# EAGLE design Orpheus Leap Micro (EAGLE 9.6.2)
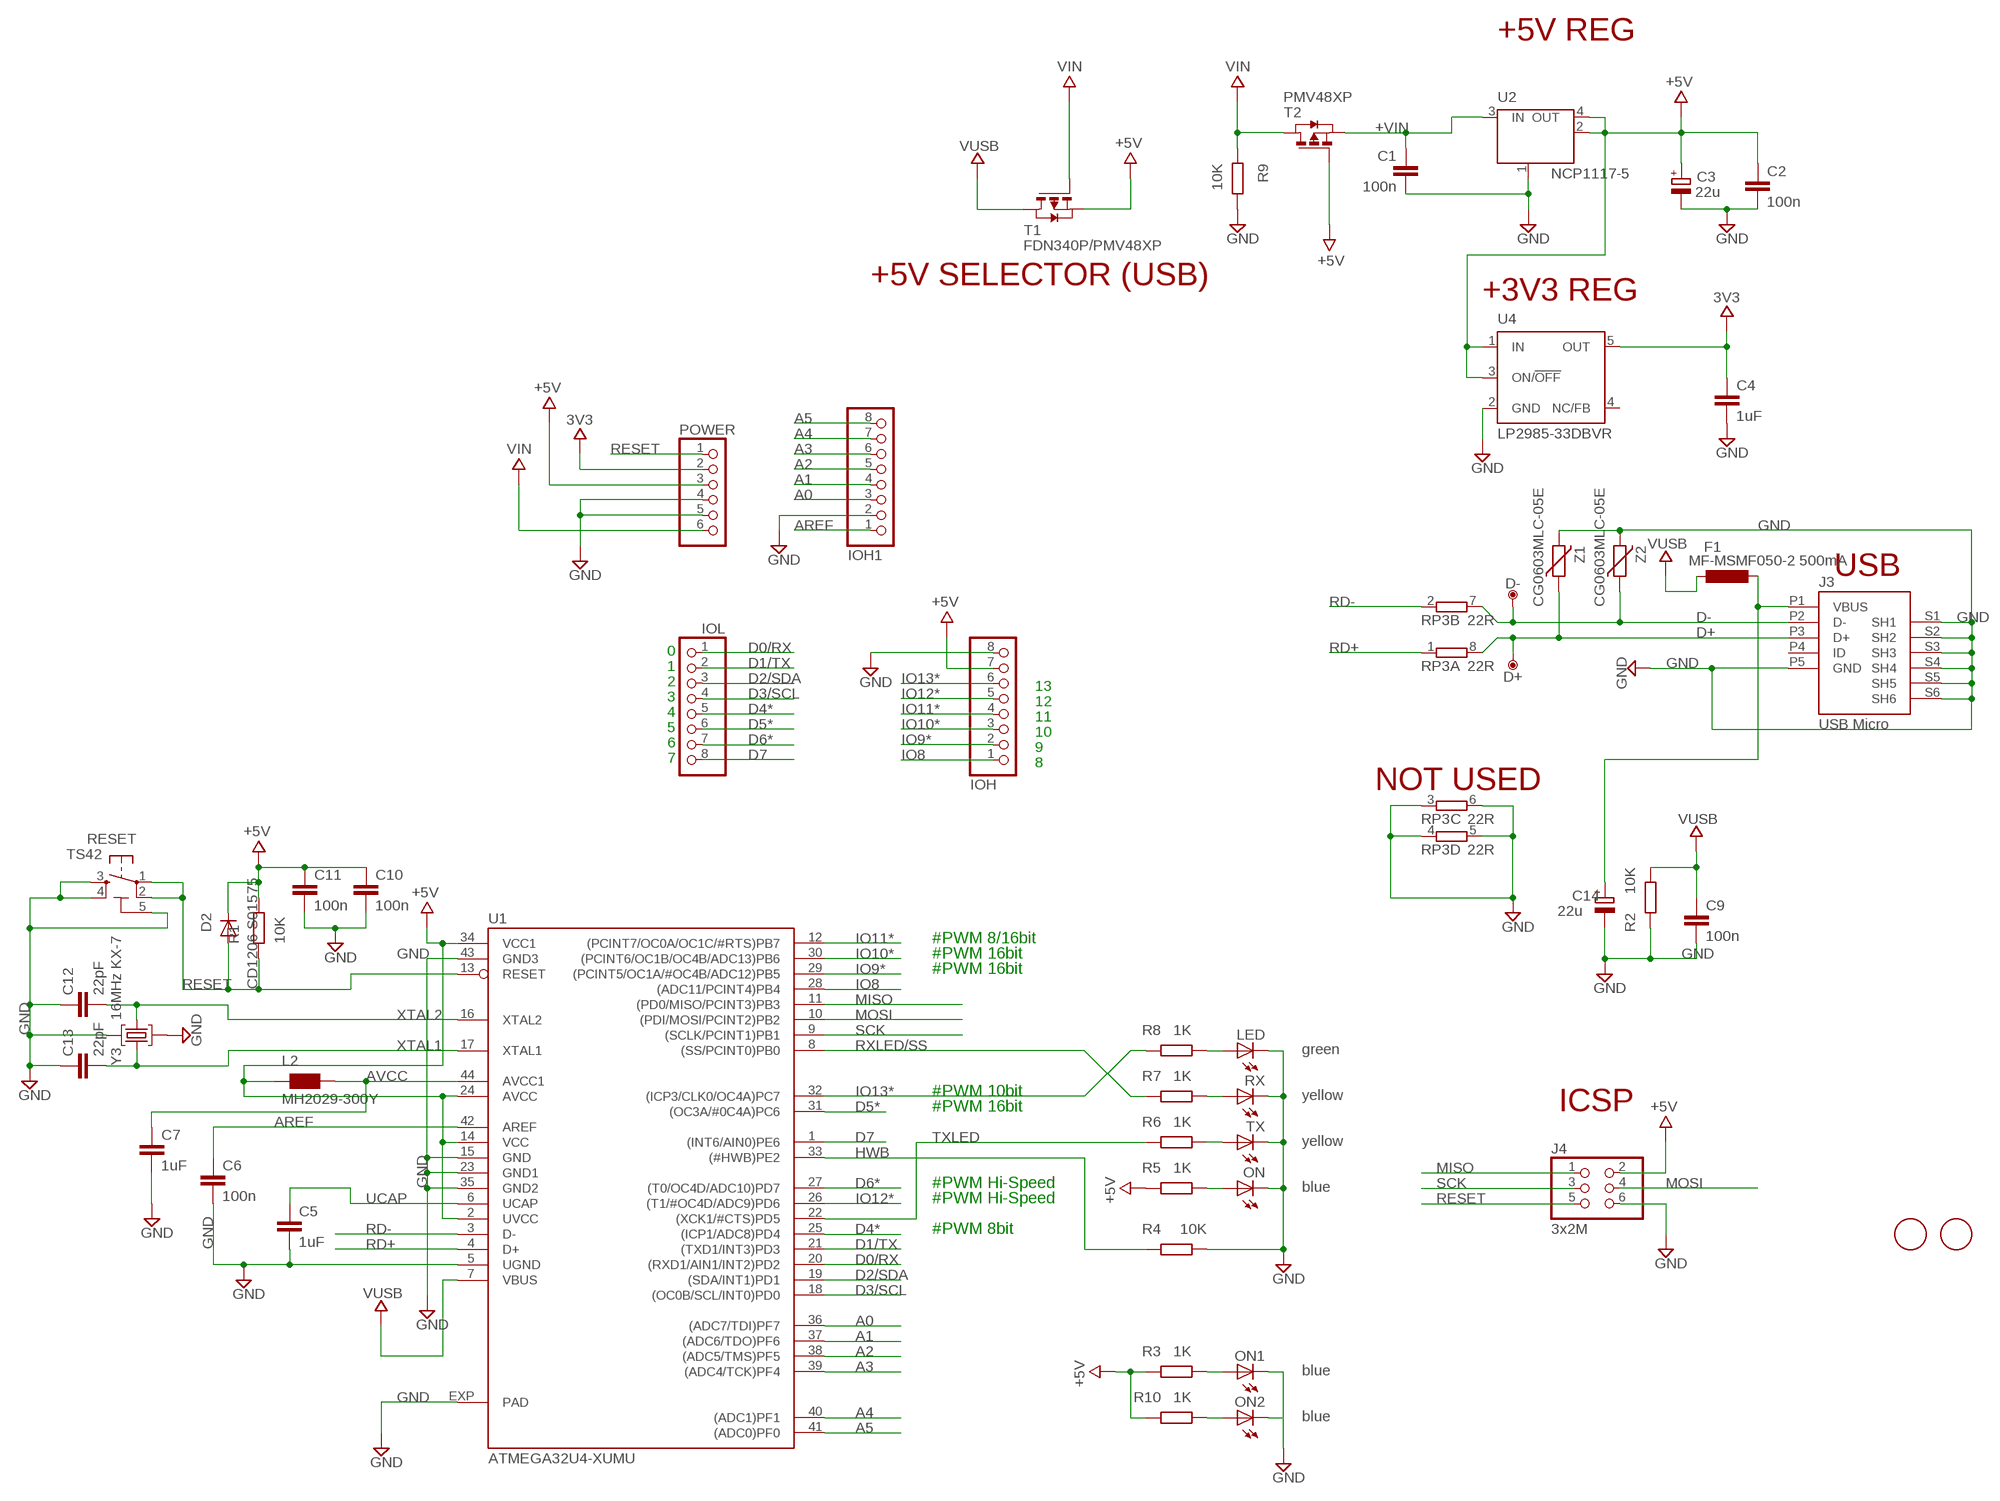
[diagram p0: schematic, sheet 1]

## Parts
C1  100n  C-EUC0402  [C0402]
C2  100n  C-EUC0402  [C0402]
C3  22u  CPOL-EUSMCB  [SMC_B]
C4  1uF  C-EUC0402  [C0402]
C5  1uF  C-EUC0402  [C0402]
C6  100n  C-EUC0402  [C0402]
C7  1uF  C-EUC0402  [C0402]
C9  100n  C-EUC0402  [C0402]
C10  100n  C-EUC0402  [C0402]
C11  100n  C-EUC0402  [C0402]
C12  22pF  C-EUC0402  [C0402]
C13  22pF  C-EUC0402  [C0402]
C14  22u  CPOL-EUSMCB  [SMC_B]
D2  CD1206-S01575  DIODE-MINIMELF  [MINIMELF]
D+  DNP  TPTP-1.00MM  [TP-1.00MM]
D-  DNP  TPTP-1.00MM  [TP-1.00MM]
F1  MF-MSMF050-2 500mA  L-EUL1812  [L1812]
IOH  PINHD-1X8  [1X08]
IOH1  PINHD-1X8  [1X08]
IOL  PINHD-1X8  [1X08]
J3  USB Micro  USB-MICRO-LEGACY  [CON2_USB_MICRO_B_AT]
J4  3x2M  PINHD-2X3  [2X03]
L2  MH2029-300Y  WE-CBF_0805  [0805]
LED  green  LEDCHIPLED_0805  [CHIPLED_0805]
ON  blue  LEDCHIPLED_0805  [CHIPLED_0805]
ON1  blue  LEDCHIPLED_0805  [CHIPLED_0805]
ON2  blue  LEDCHIPLED_0805  [CHIPLED_0805]
POWER  PINHD-1X6  [1X06]
R1  10K  R-EU_R0402  [R0402]
R2  10K  R-EU_R0402  [R0402]
R3  1K  R-EU_R0402  [R0402]
R4  10K  R-EU_R0402  [R0402]
R5  1K  R-EU_R0402  [R0402]
R6  1K  R-EU_R0402  [R0402]
R7  1K  R-EU_R0402  [R0402]
R8  1K  R-EU_R0402  [R0402]
R9  10K  R-EU_R0402  [R0402]
R10  1K  R-EU_R0402  [R0402]
RESET  TS42  [TS42]
RP3  22R  4R-NCAY16  [CAY16]
RX  yellow  LEDCHIPLED_0805  [CHIPLED_0805]
T1  FDN340P/PMV48XP  PMOSSOT23  [SOT-23]
T2  PMV48XP  PMOSSOT23  [SOT-23]
TX  yellow  LEDCHIPLED_0805  [CHIPLED_0805]
U1  ATMEGA32U4-XUMU  [QFN44ML7X7]
U2  NCP1117-5  LINEAR_MC33269ST  [SOT223]
U4  LP2985-33DBVR  LP2985-XXDBVR33  [SOT23-DBV]
U$37  DNP  FIDUCIAL-1.5MM  [FD-1-1.5]
U$53  DNP  FIDUCIAL-1.5MM  [FD-1-1.5]
Y3  16MHz KX-7  CRYSTAL-3.2-2.5  [CRYSTAL-3.2-2.5]
Z1  CG0603MLC-05E  VARISTORCN0603  [CT/CN0603]
Z2  CG0603MLC-05E  VARISTORCN0603  [CT/CN0603]

## Nets
3V3: C4.1 POWER.2 U4.5(OUT)
+5V: C2.1 C3.+ C10.1 C11.1 D2.C IOH.7 J4.2 L2.1 POWER.3 R1.1 R3.1 R5.1 R10.1 T1.2(S) T2.3(G) U1.2(UVCC) U1.14(VCC) U1.24(AVCC) U1.34(VCC1) U2.2(OUT) U2.4(OUT) U4.1(IN) U4.3(ON/!OFF)
+VIN: C1.1 T2.2(S) U2.3(IN)
A0: IOH1.3 U1.36((ADC7/TDI)PF7)
A1: IOH1.4 U1.37((ADC6/TDO)PF6)
A2: IOH1.5 U1.38((ADC5/TMS)PF5)
A3: IOH1.6 U1.39((ADC4/TCK)PF4)
A4: IOH1.7 U1.40((ADC1)PF1)
A5: IOH1.8 U1.41((ADC0)PF0)
AREF: C6.1 IOH1.1 U1.42(AREF)
AVCC: C7.1 L2.2 U1.44(AVCC1)
D0/RX: IOL.1 U1.20((RXD1/AIN1/INT2)PD2)
D1/TX: IOL.2 U1.21((TXD1/INT3)PD3)
D2/SDA: IOL.3 U1.19((SDA/INT1)PD1)
D3/SCL: IOL.4 U1.18((OC0B/SCL/INT0)PD0)
D4*: IOL.5 U1.25((ICP1/ADC8)PD4)
D5*: IOL.6 U1.31((OC3A/#0C4A)PC6)
D6*: IOL.7 U1.27((T0/OC4D/ADC10)PD7)
D7: IOL.8 U1.1((INT6/AIN0)PE6)
D+: D+.X J3.P3(D+) RP3.8 Z1.1
D-: D-.X J3.P2(D-) RP3.7 Z2.1
GND: C1.2 C2.2 C3.- C4.2 C5.2 C6.2 C7.2 C9.2 C10.2 C11.2 C12.1 C13.1 C14.- IOH1.2 IOH.8 J3.P5(GND) J3.S1(SH1) J3.S2(SH2) J3.S3(SH3) J3.S4(SH4) J3.S5(SH5) J3.S6(SH6) J4.6 LED.C ON1.C ON2.C ON.C POWER.4 POWER.5 R2.1 R4.2 R9.1 RESET.3 RESET.4 RESET.5(5-GND) RP3.3 RP3.4 RP3.5 RP3.6 RX.C TX.C U1.5(UGND) U1.15(GND) U1.23(GND1) U1.35(GND2) U1.43(GND3) U1.EXP(PAD) U2.1(GND/ADJ) U4.2(GND) Y3.2(GND) Y3.4(GND) Z1.2 Z2.2
HWB: R4.1 U1.33((#HWB)PE2)
IO8: IOH.1 U1.28((ADC11/PCINT4)PB4)
IO9*: IOH.2 U1.29((PCINT5/OC1A/#OC4B/ADC12)PB5)
IO10*: IOH.3 U1.30((PCINT6/OC1B/OC4B/ADC13)PB6)
IO11*: IOH.4 U1.12((PCINT7/OC0A/OC1C/#RTS)PB7)
IO12*: IOH.5 U1.26((T1/#OC4D/ADC9)PD6)
IO13*: IOH.6 R8.1 U1.32((ICP3/CLK0/OC4A)PC7)
MISO: J4.1 U1.11((PD0/MISO/PCINT3)PB3)
MOSI: J4.4 U1.10((PDI/MOSI/PCINT2)PB2)
N$1: ON1.A R3.2
N$2: R7.2 RX.A
N$3: ON.A R5.2
N$4: R6.2 TX.A
N$5: ON2.A R10.2
N$7: LED.A R8.2
RD+: RP3.1 U1.4(D+)
RD-: RP3.2 U1.3(D-)
RESET: D2.A J4.5 POWER.1 R1.2 RESET.1 RESET.2 U1.13(RESET)
RXLED/SS: R7.1 U1.8((SS/PCINT0)PB0)
SCK: J4.3 U1.9((SCLK/PCINT1)PB1)
TXLED: R6.1 U1.22((XCK1/#CTS)PD5)
UCAP: C5.1 U1.6(UCAP)
VIN: POWER.6 R9.2 T1.3(G) T2.1(D)
VUSB: C9.1 F1.2 R2.2 T1.1(D) U1.7(VBUS)
VUSBD: C14.+ F1.1 J3.P1(VBUS)
XTAL1: C13.2 U1.17(XTAL1) Y3.3(C2)
XTAL2: C12.2 U1.16(XTAL2) Y3.1(C1)
Unconnected: J3.P4(ID) U4.4(NC/FB)

## Notes on the sheet
- +5V REG
- +5V SELECTOR (USB)
- +3V3 REG
- USB
- 0
- 1
- 2
- 3 | 13
- 4 | 12
- 5 | 11
- 6 | 10
- 7 | 9
- 8
- NOT USED
- #PWM 8/16bit
- #PWM 16bit
- #PWM 16bit
- #PWM 10bit
- #PWM 16bit | ICSP
- #PWM Hi-Speed
- #PWM Hi-Speed
- #PWM 8bit

## Library data of the parts
C1 C2 C4-C7 C9-C13 = gen_comp:C-EU: CAPACITOR, European symbol
C3 C14 = rcl:CPOL-EU: POLARIZED CAPACITOR, European symbol
D2 = diode:DIODE-: DIODE
D+ D- = Arduino-utility:TP: Testpoint; DATASHEET: DNP; DISTRIBUTOR-LINK: DNP; DISTRIBUTOR-PN: DNP; MANUFACTURER: DNP; MANUFACTURER-PN: DNP
F1 = rcl:L-EU: INDUCTOR, European symbol
IOH IOH1 IOL = pinhead:PINHD-1X8: PIN HEADER
J3 = Arduino-connectors:USB-MICRO-LEGACY; DATASHEET: http://media.digikey.com/pdf/Data%20Sheets/FCI%20PDFs/10118193-0001LF_Webpage.PDF; DISTRIBUTOR-LINK: http://www.digikey.it/product-detail/en/10118193-0001LF/609-4616-2-ND/2785388; DISTRIBUTOR-PN: 609-4616-2-ND; MANUFACTURER: FCI; MANUFACTURER-PN: 10118193-0001LF
J4 = gen_comp:PINHD-2X3: PIN HEADER
L2 = wuerth-elektronik:WE-CBF: SMD EMI Suppression Ferrite Beads - excellent anti-EMI properties - low DCR - impedances till 3000 ohms - rated current up to 6 A
LED ON ON1 ON2 RX TX = led:LED: LED OSRAM: - CHIPLED LG R971, LG N971, LY N971, LG Q971, LY Q971, LO R971, LY R971 LH N974, LH R974 LS Q976, LO Q976, LY Q976 LO Q996 - Hyper CHIPLED LW Q18S LB Q993, LB Q99A, LB R99A - SideLED LS A670, LO A670, LY A670, LG A670, LP A670 LB A673, LV A673, LT A673, LW A673 LH A674 LY A675 LS A676, LA A676, LO A676, LY A676, LW A676 LS A679, LY A679, LG A679 - Hyper Micro SIDELED® LS Y876, LA Y876, LO Y876, LY Y876 LT Y87S - SmartLED LW L88C, LW L88S LB L89C, LB L89S, LG L890 LS L89K, LO L89K, LY L89K LS L896, LA L896, LO L896, LY L896 - TOPLED LS T670, LO T670, LY T670, LG T670, LP T670 LSG T670, LSP T670, LSY T670, LOP T670, LYG T670 LG T671, LOG T671, LSG T671 LB T673, LV T673, LT T673, LW T673 LH T674 LS T676, LA T676, LO T676, LY T676, LB T676, LH T676, LSB T676, LW T676 LB T67C, LV T67C, LT T67C, LS T67K, LO T67K, LY T67K, LW E67C LS E67B, LA E67B, LO E67B, LY E67B, LB E67C, LV E67C, LT E67C LW T67C LS T679, LY T679, LG T679 LS T770, LO T770, LY T770, LG T770, LP T770 LB T773, LV T773, LT T773, LW T773 LH T774 LS E675, LA E675, LY E675, LS T675 LS T776, LA T776, LO T776, LY T776, LB T776 LHGB T686 LT T68C, LB T68C - Hyper Mini TOPLED® LB M676 - Mini TOPLED Santana® LG M470 LS M47K, LO M47K, LY M47K Source: http://www.osram.convergy.de LUXEON: - LUMILED® LXK2-PW12-R00, LXK2-PW12-S00, LXK2-PW14-U00, LXK2-PW14-V00 LXK2-PM12-R00, LXK2-PM12-S00, LXK2-PM14-U00 LXK2-PE12-Q00, LXK2-PE12-R00, LXK2-PE12-S00, LXK2-PE14-T00, LXK2-PE14-U00 LXK2-PB12-K00, LXK2-PB12-L00, LXK2-PB12-M00, LXK2-PB14-N00, LXK2-PB14-P00, LXK2-PB14-Q00 LXK2-PR12-L00, LXK2-PR12-M00, LXK2-PR14-Q00, LXK2-PR14-R00 LXK2-PD12-Q00, LXK2-PD12-R00, LXK2-PD12-S00 LXK2-PH12-R00, LXK2-PH12-S00 LXK2-PL12-P00, LXK2-PL12-Q00, LXK2-PL12-R00 Source: www.luxeon.com KINGBRIGHT: KA-3528ASYC Source: www.kingbright.com
POWER = pinhead:PINHD-1X6: PIN HEADER
R1-R10 = gen_comp:R-EU_: RESISTOR, European symbol
RESET = Arduino:TS42: TS42 Dongnan Electronics Tact switch VDC 12V - 50mA
RP3 = resistor-dil:4R-N: Array Chip Resistor Source: RS Component / Phycomp
T1 T2 = zetex:PMOSSOT23: MOS FET
U1 = gen_comp:ATMEGA32U4-XU
U2 = gen_comp:LINEAR_MC33269ST*: Adjustable Output Low Dropout Voltage Regulator 800 mA Source: http://www.onsemi.com/pub/Collateral/MC33269-D.PDF
U4 = gen_comp:LP2985-XXDBVR: ULTRALOW-POWER 50-mA LOW-DROPOUT LINEAR REGULATORS 50-mA Low-Dropout Regulator Source: http://focus.ti.com/lit/ds/symlink/tps77001.pdf
U$37 U$53 = Arduino-utility:FIDUCIAL: Fiducial mount; DATASHEET: DNP; DISTRIBUTOR-LINK: DNP; DISTRIBUTOR-PN: DNP; MANUFACTURER: DNP; MANUFACTURER-PN: DNP
Y3 = gen_comp:CRYSTAL-3.2-2.5
Z1 Z2 = varistor:VARISTOR: VARISTOR

## Net classes
0 default: width 0.152 mm, drill 0.305 mm, clearance 0.152 mm

## Board
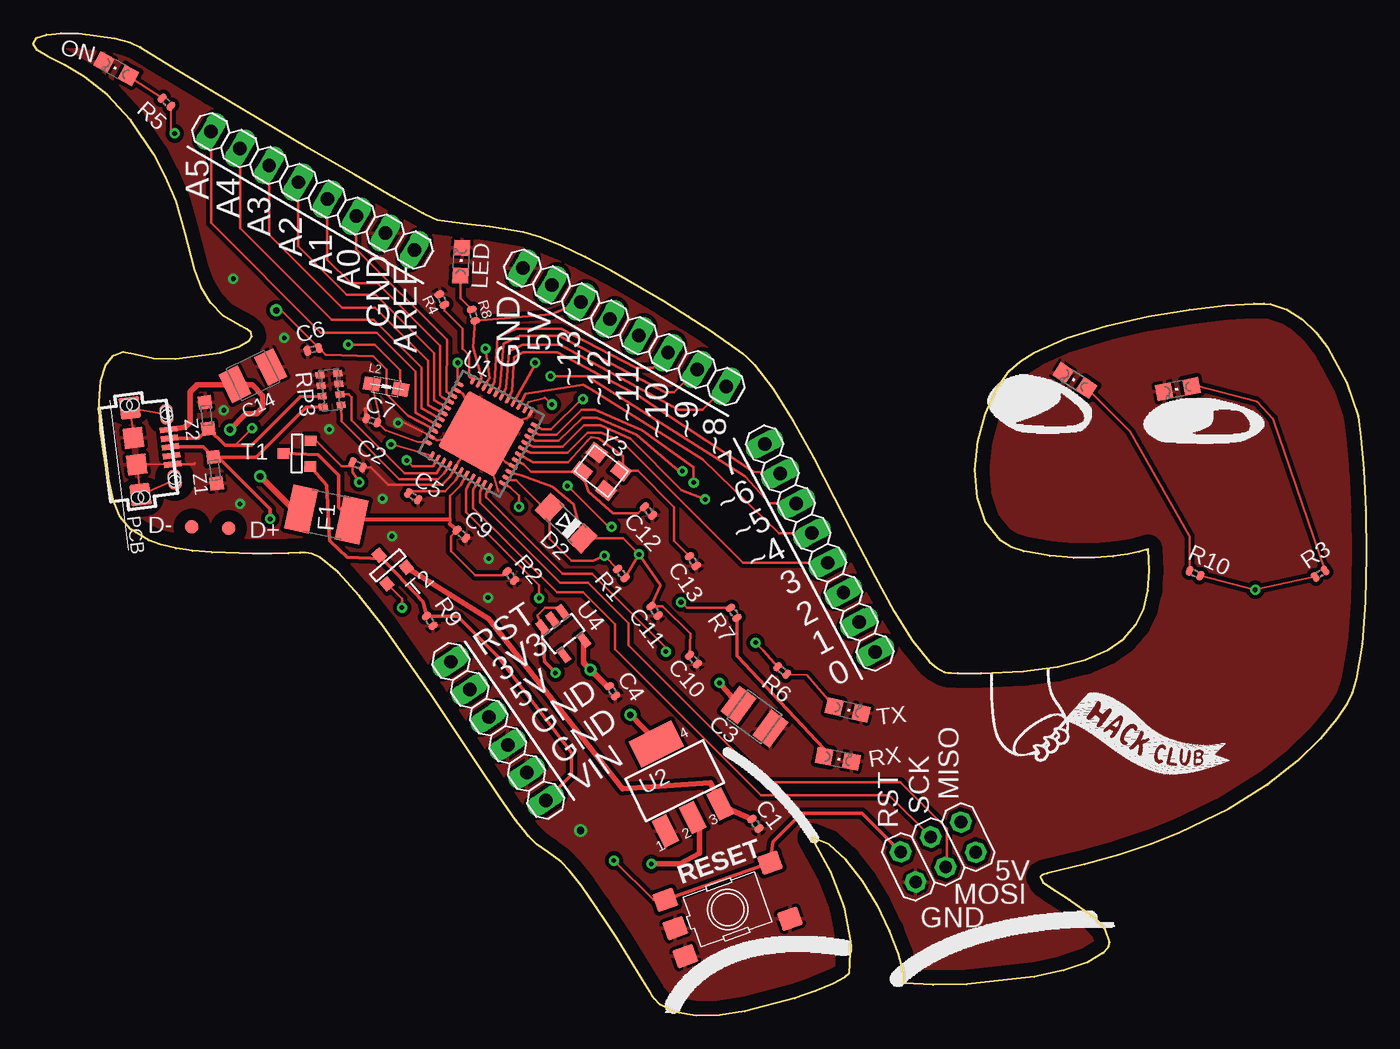
[diagram p1: board, top side]
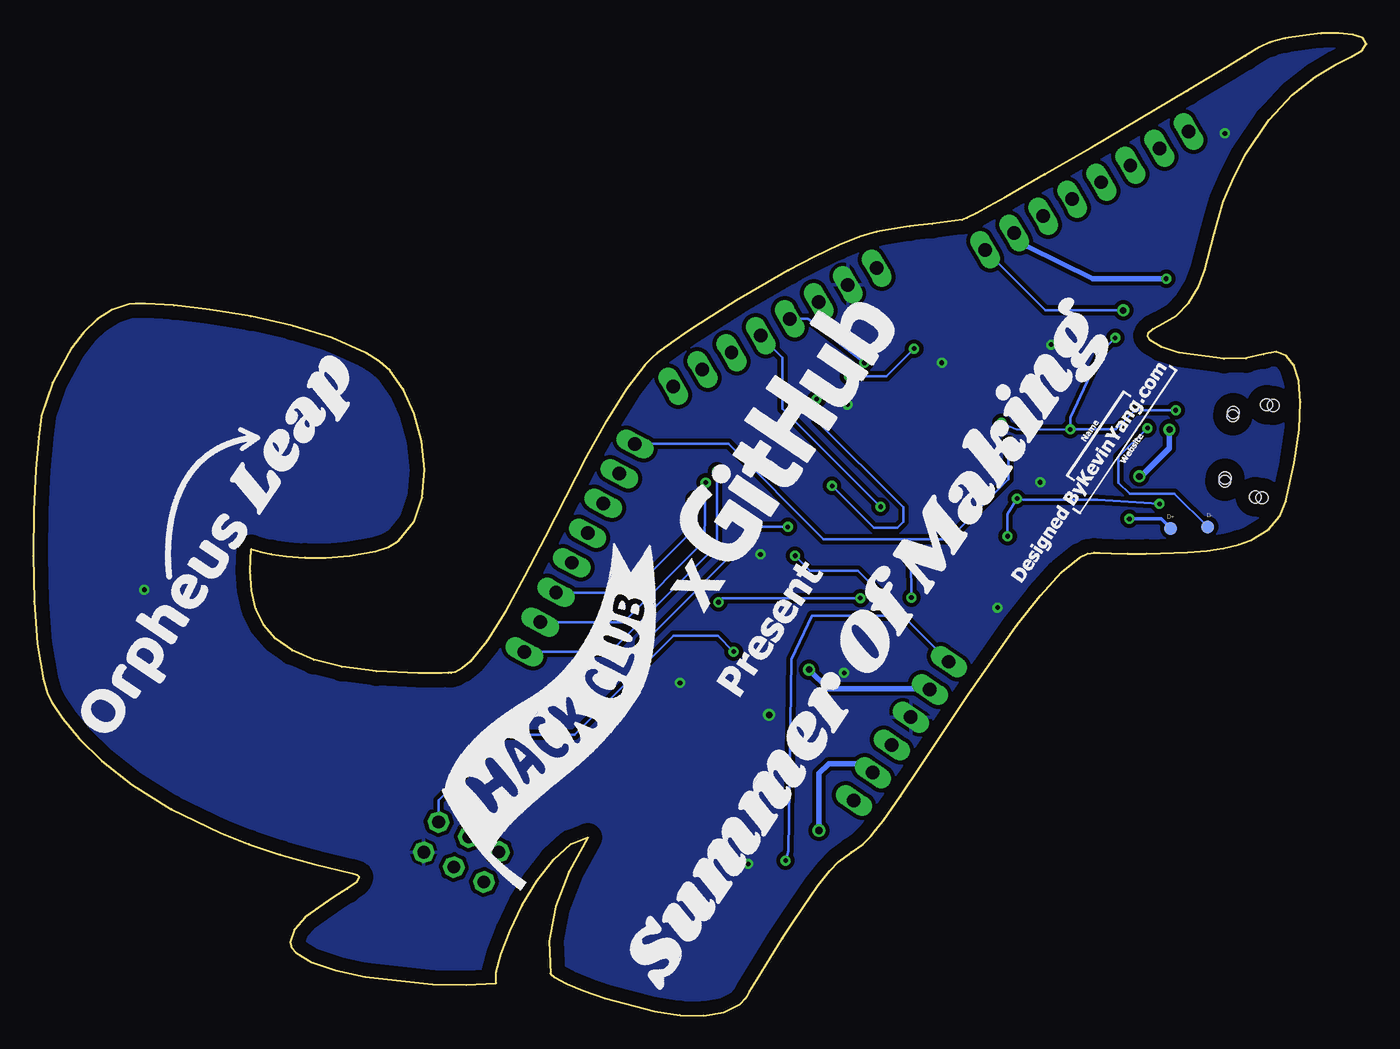
[diagram p2: board, bottom side, seen from below]

Size 100.75 x 74.23 mm. Coordinates in mm from the lower left corner, seen from the top.
Outline: 8.1,73.16 9.15,72.51 10.43,71.73 13.53,69.86 20.78,65.58 24.29,63.55 27.3,61.83 28.52,61.15 29.49,60.63 30.17,60.27 30.53,60.12 32.81,59.81 34.53,59.63 35.66,59.46 37.02,59.22 38.32,58.84 39.91,58.2 41.72,57.33 43.67,56.31 47.63,54.02 49.49,52.86 51.16,51.77 52.56,50.81 53.6,50.03 53.96,49.72 54.17,49.53 54.51,49.18 55.93,47.35 57.42,44.96 58.96,42.18 62.07,36.14 63.6,33.2 65.07,30.55 66.45,28.34 67.73,26.76 68.32,26.25 68.87,25.96 69.13,25.9 69.38,25.89 69.85,25.88 71.65,25.88 74.8,26.02 77.41,26.36 79.52,26.89 81.18,27.6 82.44,28.49 83.34,29.54 83.92,30.75 84.24,32.1 84.34,33.61 84.27,35.24 84.09,35.18 83.56,35.04 82.73,34.87 81.61,34.7 80.23,34.6 78.63,34.59 76.82,34.74 74.85,35.09 73.91,35.41 73.12,35.9 71.97,37.31 71.35,39.14 71.18,41.23 71.41,43.4 71.96,45.49 72.78,47.33 73.79,48.74 74.59,49.43 75.61,50.08 78.14,51.2 81.12,52.11 84.29,52.82 87.38,53.33 90.12,53.66 92.26,53.79 93.02,53.79 93.52,53.75 94.76,53.34 95.9,52.61 96.93,51.62 97.85,50.45 99.29,47.82 100.12,45.27 100.23,44.62 100.34,43.7 100.55,41.24 100.7,38.15 100.75,34.74 100.68,31.3 100.44,28.1 99.99,25.44 99.68,24.4 99.31,23.61 98.5,22.42 97.28,20.94 95.56,19.25 93.27,17.44 90.31,15.6 86.61,13.82 84.45,12.97 82.07,12.17 79.47,11.43 76.63,10.75 76.28,10.64 76.13,10.49 76.32,10.09 77.02,9.58 78.03,8.96 80.21,7.42 80.99,6.52 81.31,5.54 81.21,5.13 80.89,4.74 79.69,4.03 77.89,3.42 75.65,2.93 70.55,2.37 68.03,2.33 65.75,2.46 65.76,3.29 65.4,4.68 64.72,6.43 63.79,8.33 62.68,10.19 61.44,11.8 60.13,12.96 58.83,13.47 58.83,13.47 60.26,10.88 61.27,8.23 61.76,5.63 61.67,3.19 61.33,2.89 60.46,2.44 59.16,1.89 57.54,1.31 53.79,0.32 51.89,0.05 50.1,0 48.55,0.25 47.35,0.86 46.91,1.32 46.82,1.45 46.6,1.81 46.04,2.73 45.02,4.4 44.11,5.85 43.3,7.1 42.59,8.17 41.43,9.82 40.55,10.94 39.88,11.65 38.93,12.36 38.04,12.97 37.45,13.56 37.05,14.03 36.51,14.73 35.21,16.57 33.67,18.87 30.12,24.2 26.4,29.48 24.64,31.73 23.04,33.49 21.66,34.63 21.07,34.91 20.57,34.98 20.15,34.96 19.27,34.93 18.06,34.91 16.63,34.91 13.51,35.01 12.05,35.12 10.8,35.31 9.67,35.58 8.73,35.91 7.36,36.74 6.53,37.74 6.09,38.85 5.45,41.79 5.09,44.29 4.98,46.35 5.12,47.97 5.48,49.14 6.06,49.87 6.83,50.14 7.78,49.96 9.1,49.67 10.75,49.62 14.17,50.08 15.53,50.52 16.36,51.03 16.52,51.31 16.46,51.59 16.17,51.87 15.62,52.15 14.37,52.86 13.42,53.84 12.71,55.03 12.19,56.35 11.47,59.09 10.8,61.53 10,63.4 9.16,65.03 7.38,67.66 5.59,69.58 3.88,70.92 2.36,71.83 1.14,72.45 0.31,72.94 0,73.42 0.26,73.86 1.02,74.12 2.12,74.23 3.43,74.2 6.16,73.83 7.29,73.52 8.1,73.16
Copper layers (1*16): Top 0.035mm / dielectric 1.5mm / Bottom 0.035mm
Design rules "default": minimum track width 6mil, minimum drill 0.35mm, track to track 6mil, track to pad 6mil, pad to pad 6mil, via to via 6mil, smd to smd 6mil, copper to edge 40mil, drill to drill 6mil, minimum pad ring 10mil, minimum via ring 8mil, stop-mask expansion 4mil, vias tented up to drill 0mil, thermal gap 10mil

### Footprints (pad centres in the part's own frame; a part is rotated, then mirrored left to right if it is on the bottom)
C0402 = smd 0.508 x 0.762: 1 -0.445,0; 2 0.445,0
SMC_B = smd 1.6 x 2.4: + -1.5,0; - 1.5,0
MINIMELF = smd 1.4 x 1.8: A 1.7,0; C -1.7,0
TP-1.00MM = smd 1 x 1 bottom: X 0,0
L1812 = smd 1.9 x 3.4: 1 -1.95,0; 2 1.95,0
1X08 = drill 1.016 long: 1 -8.89,0; 2 -6.35,0; 3 -3.81,0; 4 -1.27,0; 5 1.27,0; 6 3.81,0; 7 6.35,0; 8 8.89,0
CON2_USB_MICRO_B_AT = smd 0.406 x 1.346: P1 -1.321,2.692; P2 -0.66,2.692; P3 0,2.692; P4 0.66,2.692; P5 1.321,2.692 | smd 1.651 x 1.549: S1 -3.302,0; S2 3.302,0 | smd 1.524 x 1.016: S3 -2.489,2.692; S4 2.489,2.692 | smd 1.524 x 1.524: S5 -1.016,0; S6 1.016,0 | hole 0.9: -3.505,0.254; -3.505,-0.254; 3.505,0.254; 3.505,-0.254; -2.616,2.692; -2.362,2.692; 2.362,2.692; 2.616,2.692
2X03 = drill 0.95 pad 1.55 octagon: 1 -2.54,-1.27; 2 -2.54,1.27; 3 0,-1.27; 4 0,1.27; 5 2.54,-1.27; 6 2.54,1.27
0805 = smd 1.2 x 1: 1 -1.1,0; 2 1.1,0
CHIPLED_0805 = smd 1.2 x 1.2: A 0,-1.05; C 0,1.05
1X06 = drill 1.016 long: 1 -6.35,0; 2 -3.81,0; 3 -1.27,0; 4 1.27,0; 5 3.81,0; 6 6.35,0
R0402 = smd 0.508 x 0.762: 1 -0.445,0; 2 0.445,0
TS42 = smd 1.6 x 1.4: 1 -4.2,2.25; 2 4.2,2.25; 3 -4.2,-2.25; 4 4.2,-2.25; 5 -4.2,0
CAY16 = smd 0.5 x 0.65: 1 -1.2,-0.675; 2 -0.4,-0.675; 3 0.4,-0.675; 4 1.2,-0.675; 5 1.2,0.675; 6 0.4,0.675; 7 -0.4,0.675; 8 -1.2,0.675
SOT-23 = smd 0.787 x 0.889: 1 0.025,-1.016; 2 -0.94,1.016; 3 0.991,1.016
QFN44ML7X7 = smd 0.75 x 0.275: 1 -3.275,2.5; 2 -3.275,2; 3 -3.275,1.5; 4 -3.275,1; 5 -3.275,0.5; 6 -3.275,0; 7 -3.275,-0.5; 8 -3.275,-1; 9 -3.275,-1.5; 10 -3.275,-2; 11 -3.275,-2.5; 23 3.275,-2.5; 24 3.275,-2; 25 3.275,-1.5; 26 3.275,-1; 27 3.275,-0.5; 28 3.275,0; 29 3.275,0.5; 30 3.275,1; 31 3.275,1.5; 32 3.275,2; 33 3.275,2.5 | smd 0.275 x 0.75: 12 -2.5,-3.275; 13 -2,-3.275; 14 -1.5,-3.275; 15 -1,-3.275; 16 -0.5,-3.275; 17 0,-3.275; 18 0.5,-3.275; 19 1,-3.275; 20 1.5,-3.275; 21 2,-3.275; 22 2.5,-3.275; 34 2.5,3.275; 35 2,3.275; 36 1.5,3.275; 37 1,3.275; 38 0.5,3.275; 39 0,3.275; 40 -0.5,3.275; 41 -1,3.275; 42 -1.5,3.275; 43 -2,3.275; 44 -2.5,3.275 | smd 4.826 x 4.826: EXP 0,0
SOT223 = smd 1.219 x 2.235: 1 -2.311,-3.099; 2 0,-3.099; 3 2.311,-3.099 | smd 3.6 x 2.2: 4 0,3.099
SOT23-DBV = smd 0.55 x 1.2: 1 -0.95,-1.3; 2 0,-1.3; 3 0.95,-1.3; 4 0.95,1.3; 5 -0.95,1.3
FD-1-1.5 = smd 1.016 x 1.016: P$1 0,0
CRYSTAL-3.2-2.5 = smd 1.3 x 1.05: 1 -1.15,-0.925; 2 1.15,-0.925; 3 1.15,0.925; 4 -1.15,0.925
CT/CN0603 = smd 1 x 1: 1 -1,0; 2 1,0

### Placement (x,y rotation side)
C1  54.58,14.49 306.7 top
C2  24.53,41.61 332.8 top
C3  54.51,22.58 323.6 top
C4  43.78,24.52 303.4 top
C5  28.72,39.23 326.3 top
C6  21.16,50.34 194.1 top
C7  25.6,44.96 160 top
C9  32.38,36.38 318.3 top
C10  49.9,26.9 311.3 top
C11  46.97,30.58 307.4 top
C12  46.51,38.12 133.3 top
C13  49.86,34.35 125 top
C14  16.6,48.36 25.8 top
D2  40.27,37.21 137.3 top
D+  14.79,36.82 0 top
D-  12,36.93 0 top
F1  22.17,37.87 347.6 top
IOH  44.68,52.01 149.8 top
IOH1  21.13,62.32 149.8 top
IOL  59.45,35.34 118 top
J3  7.71,42.64 277 top
J4  68.39,12.36 206.3 top
L2  26.68,47.52 169.4 top
LED  32.35,56.95 357 top
ON  6.29,71.53 61.5 top
ON1  86.5,47.34 101.2 top
ON2  78.72,47.99 57.4 top
POWER  35.15,21.5 304.4 top
R1  44.46,33.41 130.4 top
R2  36.09,33.22 130.3 top
R3  97.25,33.39 33.4 top
R4  30.9,54.1 115.9 top
R5  10.08,69.01 137.7 top
R6  56.61,26.08 321.4 top
R7  52.94,30.44 303.3 top
R8  33.27,52.93 107.2 top
R9  29.98,29.82 124.4 top
R10  87.79,33.42 155.6 top
RESET  52.48,8.03 19.6 top
RP3  22.48,47.26 96 top
RX  60.81,19.41 259.3 top
T1  19.94,42.5 269.6 top
T2  26.83,34.04 220.7 top
TX  61.55,23.1 256.3 top
U1  33.87,43.96 61.3 top
U2  48.47,17.75 26.4 top
U4  40.06,28.86 217.4 top
U$37  14.79,36.82 0 top
U$53  12,36.93 0 top
Y3  42.94,41.12 322.3 top
Z1  13.75,41.21 277 top
Z2  13.11,45.34 97 top

### Tracks (layer width: path | path; a pad name or v marks a point on that pad's centre or on a via)
3V3  (via drill 0.5)
  Top 0.406: C4.1 43.37,24.9 v42.12,26.15 41.61,26.66 U4.5
  Bottom 0.406: v42.12,26.15 40.65,24.68 33.03,24.68 POWER.2
+5V  (via drill 0.35, 0.5)
  Top 0.152: R5.1 10.4,66.96 v10.71,66.64 | U1.24 37.43,46.38 38.69,46.69 v39.2,46.17 | 88.28,33.15 R10.1 92.24,32.17 v92.35,32.17 R3.1
  Top 0.2: 38.44,29.39 U4.3 38.14,30.22 38.14,30.25 38.69,30.8 39.69,30.8 U4.1 | T1.2 21.37,43.43 23.3,41.5 24.13,41.5 C2.1 24.13,41.06 v24.64,40.3 | L2.1 27.72,48.76 25.79,50.69 v23.81,50.69 | T2.3 27.88,31.48 v27.88,30.83 | v45.79,34.85 44.58,36.05 D2.C 40.83,38.65 39.25,39.97 36.87,40.84 U1.14 | U1.2 30.21,41.5 28.69,41.5 v28.23,41.96 | U1.34 32.09,47.83 v32.09,49.32 | C11.1 47.43,32.52 v45.79,34.85 | 46.82,30.84 C11.1 | C10.1 49.67,28.85 47.58,30.94 C11.1 | R1.1 v45.79,34.85
  Top 0.254: U4.3 38.52,28.57 38.63,26.73 v39.47,25.9
  Top 0.406: U2.4 47.1,20.68 v45.13,22.73 | C3.+ v51.87,25.15 | v46.71,11.47 48.88,11.47 50.36,12.27 50.36,14.47 U2.2
  pour Bottom (isolate 0.305): -6.41,77.82 -0.06,-1.94 94.93,-1.94 111.19,57.5
+VIN
  Top 0.406: T2.2 34.43,29.98 44.56,17.16 51.18,17.58 U2.3 52.15,15.77 C1.1
A0
  Top 0.2: IOH1.3 24.42,57.9 31.28,51.05 31.23,47.14 U1.36
A1
  Top 0.2: IOH1.4 22.23,57.1 24.01,55.32 26.05,55.32 30.77,50.59 30.77,46.88 30.92,46.73 U1.37
A2
  Top 0.2: IOH1.5 20.03,58.13 23.71,54.45 25.89,54.45 30.31,50.03 30.31,46.48 31.2,46 U1.38
A3
  Top 0.2: IOH1.6 17.84,59 23.35,53.49 25.84,53.49 29.86,49.47 29.86,46.13 30.98,45.53 U1.39
A4
  Top 0.2: IOH1.7 15.64,59.47 22.54,52.57 25.74,52.57 29.35,48.97 29.35,45.9 U1.40
A5
  Top 0.2: IOH1.8 13.45,59.89 21.73,51.61 25.95,51.61 28.89,48.66 28.89,45.56 U1.41
AREF  (via drill 0.5)
  Top 0.2: U1.42 30.09,44.4 28.32,45.32 26.71,46.93 26.71,48.81 25.69,49.83 22.12,49.92 C6.1 18.76,53.28 v18.38,53.28
  Bottom 0.2: IOH1.1 24.25,53.28 v18.38,53.28
AVCC
  Top 0.152: L2.2 26.18,45.28 C7.1 26.6,44.22 29.08,43.34 U1.44
D0/RX  (via drill 0.35)
  Top 0.2: U1.20 37.98,43.43 39.71,43.43 41.51,45.16 42.6,45.16 45.59,43.9 48.81,41.14 v49.06,41.14
  Bottom 0.2: v49.06,41.14 49.06,35.55 57.12,27.49 IOL.1
D1/TX  (via drill 0.35)
  Top 0.2: U1.21 38.24,43.89 39.56,43.89 41.44,45.77 42.45,45.77 46,44.21 49.92,41.45 v49.92,40.28
  Bottom 0.2: IOL.2 56.15,29.73 50.01,35.87 49.94,40.26 v49.92,40.28
D2/SDA  (via drill 0.35)
  Top 0.2: U1.19 37.78,42.97 40.02,42.97 41.64,44.6 42.86,44.6 45.13,43.59 49.02,39.7 v50.79,39.01
  Bottom 0.152: 61.21,31.95 IOL.3
  Bottom 0.2: v50.79,39.01 50.79,36.77 55.61,31.95 61.21,31.95
D3/SCL
  Top 0.2: U1.18 37.58,42.51 40.37,42.51 41.9,44.04 42.94,44.04 44.53,43.33 53.63,34.23 60.03,34.23 IOL.4
D4*
  Top 0.2: U1.25 37.22,46.98 41.57,47.65 42.17,47.34 50.57,42.05 56.35,36.46 IOL.5
D5*  (via drill 0.35)
  Top 0.2: U1.31 34.48,48.2 v34.17,50.39 | IOL.6 55.63,38.7 53.78,40.76 41.88,48.31 v39.1,48.31
  Bottom 0.2: v34.17,50.39 36.26,48.31 v39.1,48.31
D6*
  Top 0.2: IOL.7 54.44,41.09 45.67,46.87 39.61,50.13 37.02,50.13 36.36,49.73 36.21,47.19 U1.27
D7  (via drill 0.35)
  Top 0.152: U1.1 v27.05,43.15
  Bottom 0.2: v27.05,43.15 27.05,40.51 31.55,36.01 41.03,36.01 48.21,43.19 IOL.8
D+  (via drill 0.35)
  Top 0.254: J3.P3 12.86,42.97 Z1.1 | v17.92,37.54 17.92,38.27 13.98,42.21 Z1.1 | Z1.1 16.85,42.21 20.62,45.98 RP3.8
  Bottom 0.254: v17.92,37.54 15.51,37.54 D+.X
D-  (via drill 0.35)
  Top 0.152: 15.33,43.08 15.33,43.17 v16.55,44.39
  Top 0.254: J3.P2 12.51,43.63 Z2.1 14.5,43.08 15.33,43.08 16.5,43.08 20.19,46.77 RP3.7
  Bottom 0.2: v16.55,44.39 18.73,42.21 18.73,40.28 17.89,39.44 14.52,39.44 D-.X
GND  (via drill 0.35, 0.55)
  Top 0.152: U1.43 29.99,43.82 27.94,44.84 27.64,44.84 v27.59,44.79 | U1.EXP 35.14,39.62 | J3.P5 J3.S6 | J3.S3 J3.S1 J3.S5 | J3.S4 J3.S2 7.86,41.66
  Top 0.2: C2.2 25.52,41.42 26.81,40.13 30.92,40.13 31.48,40.69 U1.5 32.19,41.9 U1.EXP | J3.P5 12.14,41.66 12.23,41.75 | 7.86,41.66 J3.S6 | U1.23 37.38,45.16 U1.EXP | U1.43 30.52,43.48 33.72,43.94 | 33.72,43.94 U1.EXP | U1.35 32.5,46.98 U1.EXP | U1.15 35.7,41.8 33.72,43.94
  Top 0.254: C7.2 25.07,45.86
  Bottom 0.152: v27.59,44.79 26.45,44.29 v22.39,44.29
  Bottom 0.2: v27.11,36.22 27.11,37.89 v26.4,39.06 26.13,39.02 | v26.4,39.06 26.13,39.02 | v15.63,38.67 20.34,38.99 25.92,38.99 26.13,39.02 | v34.43,34.54 v34.38,31.59 | v18.99,51.2 20.08,50.1 22.39,45.18 v22.39,44.29 18.93,44.29 17.49,45.73 v14.42,45.73
  Bottom 0.406: POWER.5 37.99,19.04 40.63,19.04 41.37,18.3 v41.37,14 | v15.12,55.67 20.68,55.67 25.66,58.11 26.62,59.08 IOH1.2
  pour Top (isolate 0.305): -2.86,77.06 -2.86,40.74 42.35,-4.48 99,-4.48 114.49,11.02 114.49,61.82 110.93,65.37 99.25,77.06
HWB
  Top 0.2: U1.33 32.96,48.32 32.96,49.88 32.45,50.39 32.45,51.91 31.09,53.27 R4.1
IO8
  Top 0.2: IOH.1 50.6,45.77 48.75,45.77 39.81,50.69 36.97,50.69 35.95,50.19 35.75,47.39 U1.28
IO9*
  Top 0.2: IOH.2 48.45,47.09 47.74,47.09 39.76,51.35 36.82,51.35 35.55,50.74 35.29,47.54 U1.29
IO10*
  Top 0.2: IOH.3 46.85,48.97 45.55,48.97 39.91,51.91 36.51,51.91 35.11,51.24 34.89,47.9 U1.30
IO11*  (via drill 0.35)
  Top 0.2: U1.12 36.05,39.92 36.71,39.26 v36.71,38.45
  Bottom 0.2: IOH.4 44.13,49.72 44.13,45.87 v36.71,38.45
IO12*  (via drill 0.35)
  Top 0.2: U1.26 36.34,46.37 37.93,49.17 v37.93,49.32
  Bottom 0.2: IOH.5 42.2,52.65 v37.93,49.32
IO13*
  Top 0.2: U1.32 33.9,48.21 33.23,50.49 R8.1 39.19,52.99 IOH.6
MISO  (via drill 0.35)
  Top 0.2: v47.81,27.51 47.81,27.81 42.25,33.37 40.02,33.37 34.23,39.16 34.23,39.42 U1.11
  Bottom 0.2: J4.1 70.11,16.28 65.16,21.23 59.83,21.23 52.35,28.71 49.01,28.71 v47.81,27.51
MOSI
  Top 0.2: J4.4 69.05,11.32 69.05,14.11 65.53,17.62 55.36,17.62 45,27.99 45,29.66 41.95,32.71 39.81,32.71 33.77,38.76 33.77,39.62 U1.10
N$1
  Top 0.152: ON1.A 87.59,47.6 87.88,47.6 92.49,46.37 93.7,45.11 R3.2
N$2
  Top 0.254: RX.A 59.76,20.15 53.18,27.2 R7.2
N$3
  Top 0.152: ON.A 7.51,70.73 R5.2
N$4
  Top 0.152: R6.2 58.46,25.75 TX.A
N$5
  Top 0.152: ON2.A 82.9,44.13 87.39,36.25 R10.2
N$7
  Top 0.2: R8.2 32.29,54.2 LED.A
RD+
  Top 0.2: RP3.1 23.31,44.89 27.67,40.53 30.62,40.53 31.08,40.99 U1.4
RD-
  Top 0.2: RP3.2 23.86,46.94 24.08,46.72 24.08,44.99 28.08,40.99 30.51,40.99 U1.3
RESET  (via drill 0.35)
  Top 0.2: U1.13 36.15,40.43 36.51,40.43 38.58,38.36 D2.A 39.02,36.04 40.68,34.39 42.3,34.39 v43.17,34.74 R1.2 | 47.52,8.49 RESET.1 46.87,8.74 v43.89,11.72
  Top 0.254: RESET.1 RESET.2 55.92,13.16 58.05,15.29 62.65,15.29 J4.5
  Bottom 0.2: POWER.1 35.01,30.2 | 35.01,30.2 38.44,33.62 42.05,33.62 v43.17,34.74 | 35.01,30.2 41.89,30.2 43.45,26.92 43.66,12.45 v43.89,11.72
RXLED/SS  (via drill 0.35)
  Top 0.2: v38.24,31.54 38.24,32.51 32.7,38.04 32.7,39.77 U1.8 | R7.1 49.4,30.84 v48.96,31.24
  Bottom 0.2: v48.96,31.24 48.65,31.54 v38.24,31.54
SCK
  Top 0.2: J4.3 64.68,16.66 55,16.66 43.98,27.68 43.98,29.56 41.54,32 39.61,32 33.26,38.35 33.26,39.72 U1.9
TXLED  (via drill 0.35)
  Top 0.2: U1.22 38.44,44.29 39.15,44.29 41.44,46.58 v41.54,46.58 | v43.73,36.93 43.47,36.93 v40.37,40.03 | v54.6,28.19 55.2,27.58 R6.1
  Bottom 0.2: v41.54,46.58 41.54,44.95 34.99,38.4 34.99,37.33 35.44,36.88 37.22,36.88 v40.37,40.03 | v43.73,36.93 45.86,36.93 v54.6,28.19
UCAP
  Top 0.2: U1.6 31.94,40.43 31.13,39.62 28.49,39.62 C5.1
VIN
  Top 0.254: POWER.6 40.68,18.21 40.68,19.86 35.14,27.13 32.07,30.19 R9.2 29.49,31.28 T2.1 26.39,34.52 23.72,34.64 22.39,35.86 22.19,40.08 T1.3
VUSB
  Top 0.2: U1.7 32.3,40.08 31.49,39.27 31.49,37.45 31.49,37.14 | C9.1 31.59,36.22 31.59,35.09 33.41,33.27 35.51,33.27 R2.2
  Top 0.254: T1.1 21.55,42.39 23.11,40.83 23.11,38.41 F1.2
  Top 0.305: C9.1 31.49,37.14 | 31.49,37.45 F1.2
VUSBD  (via drill 0.5)
  Top 0.254: 15.25,47.65 C14.+
  Top 0.406: J3.P1 11.47,44.44 11.87,44.85 11.87,47.14 12.38,47.65 15.25,47.65 16.55,47.65 17.36,46.83 17.36,45.92 16.9,45.46 16.06,45.46 v14.89,44.28 | v17.16,40.74 19.61,38.29 F1.1
  Bottom 0.406: v14.89,44.28 14.89,42.85 17,40.74 v17.16,40.74
XTAL1
  Top 0.2: C13.2 48.45,35.87 48.45,38.4 45.7,41.15 Y3.3 44.57,41.3 44.59,42.26 42.74,43.62 42.25,43.69 42.15,43.69 41.9,43.43 40.42,41.8 37.78,41.8 U1.17
XTAL2
  Top 0.2: U1.16 37.07,41.65 37.63,41.1 Y3.1 41.96,39.58 43.84,37.94 45.7,37.94 C12.2

### Text on the board
tPlace: A5 | A4 | A3 | A2 | A1 | A0 | GND | 5V | GND | ~13 | AREF | ~12 | ~11 | ~10 | ~9 | ~8 | 7 | ~6 | ~5 | D- | D+ | ~4 | 3 | 2 | 1 | RST | 0 | 3V3 | 5V | GND | GND | VIN | MISO | SCK | RST | 5V | RESET | MOSI | GND